# Altium schematic sheet RF.SchDoc: RF Connectors
size A; DocumentNumber: 10; SheetNumber: 10; SheetTotal: 11
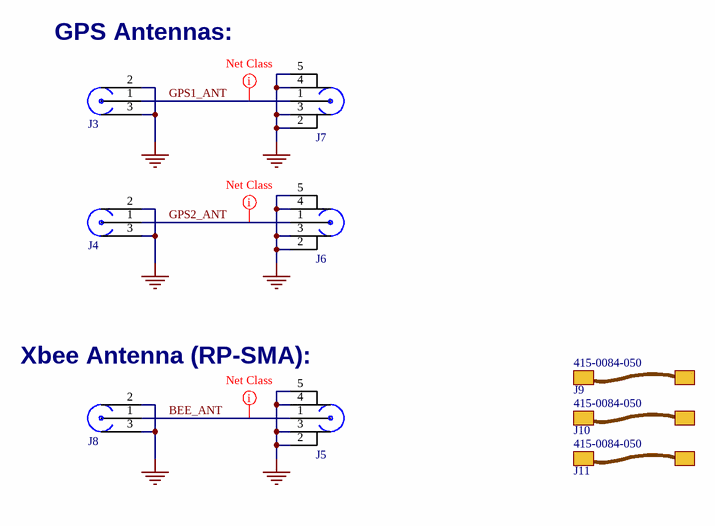
[diagram p0: RF.SchDoc]

## Parts
J3  RF - GND x 2  [RF UMC SMD]  (value not drawn)
J4  RF - GND x 2  [RF UMC SMD]  (value not drawn)
J5  RF - GND x 4  [RF RPSMA End Launch]  (value not drawn)
J6  RF - GND x 4  [RF SMA End Launch 2]  (value not drawn)
J7  RF - GND x 4  [RF SMA End Launch 2]  (value not drawn)
J8  RF - GND x 2  [RF UMC SMD]  (value not drawn)
J9  Manufacturer Part Number: 415-0084-050  (hidden comment: Cable Assembly)  (mechanical)
J10  Manufacturer Part Number: 415-0084-050  (hidden comment: Cable Assembly)  (mechanical)
J11  Manufacturer Part Number: 415-0084-050  (hidden comment: Cable Assembly)  (mechanical)

## Nets
GND: J3.2 J3.3 J4.2 J4.3 J5.2 J5.3 J5.4 J5.5 J6.2 J6.3 J6.4 J6.5 J7.2 J7.3 J7.4 J7.5 J8.2 J8.3
BEE_ANT: J5.1 J8.1
GPS1_ANT: J3.1 J7.1
GPS2_ANT: J4.1 J6.1

## Layout directives
net class RF_GPS: BEE_ANT, GPS1_ANT, GPS2_ANT

## Notes on the sheet
- (near J3) GPS Antennas:
- Xbee Antenna (RP-SMA):
- Date
- Sheet
- Project
- Time
- PCB
- Assy
- of
- Size
- A
- File

## Library data of the parts
J3 J4 J8 = RF - GND x 2: CONN UMC RCPT STR 50 OHM SMD; Manufacturer: Emerson Network Power Connectivity Johnson; Manufacturer Part Number: 128-0711-201; Connector Style: Ultra Miniature Coaxial; Connector Type: Receptacle, Male Pins; Contact Termination: Solder; Impedance: 50 Ohm; Frequency - Max: 6GHz; Body Finish: Gold; Voltage Rating: 200V; Supplier 1: Digi-Key; Supplier Part Number 1: J983CT-ND; RoHS: RoHS Compliant; Category: Connectors, Interconnects; Stock 1: 1514; Pricing 1: 1=0.93, 10=0.832, 50=0.784, 100=0.672, 250=0.576, 500=0.544, 750=0.48, 1000=0.448 (USD); Packaging: Cut Tape (CT); Shield Termination: Solder; Mounting Type: Surface Mount; Cable Group: -; Fastening Type: Snap-On; Features: -; Housing Color: Gold; Ingress Protection: -; Body Material: -; Center Contact Material: -; Center Contact Plating: Gold; Dielectric Material: -; Operating Temperature: -40°C ~ 90°C; ComponentLink1URL: http://media.digikey.com/pdf/Data%20Sheets/Emerson%20PDFs/UMC%20Product%20Catalog.pdf; ComponentLink1Description: http://media.digikey.com/pdf/Data%20Sheets/Emerson%20PDFs/UMC%20Product%20Catalog.pdf
J5 = RF - GND x 4: CONN RPSMA JCK STR 50OHM EDGEMNT; Manufacturer: Amphenol Connex; Manufacturer Part Number: 132255RP; Body Material: Brass; Body Plating: Gold; Dielectric Material: PTFE; Impedance: 50R; Mating Cycles: 500; Connector Type: Coaxial,Male Pin,SMA; Max Frequency: 18GHz; Voltage Rating: 375V; Board Thickness: 0.062inch; Supplier 1: Digi-Key; Supplier Part Number 1: ACX1425-ND; Stock 1: 513; Pricing 1: 1=7.75, 10=7.429, 25=6.7832, 50=6.46, 100=6.137, 250=5.491, 500=5.168, 1000=4.522 (USD); Mount: Edge,PCB; Case/Package: SMA; Weight: 0.126986oz; Contact Plating: Gold; Contact Material: Copper; Housing Colour: Gold; Insulation Material: Polytetrafluoroethylene; Min Operating Temperature: -65°C; Max Operating Temperature: 165°C; Package Quantity: 1; Fastening Type: Threaded; Packaging: Bulk; Termination: Solder; Frequency: 18GHz; Orientation: Straight; Length: 9.52mm; Depth: 7.92mm; Radiation Hardening: No; REACH SVHC: Unknown
J6 J7 = RF - GND x 4: CONN SMA RCPT STR 50OHM EDGE MNT; Manufacturer: Molex; Manufacturer Part Number: 0732511150; Body Material: Brass; Body Plating: Gold; Dielectric Material: PTFE; Impedance: 50R; Connector Type: SMA,Socket; Max Frequency: 18GHz; Voltage Rating: 500V; Supplier 1: Digi-Key; Supplier Part Number 1: WM5534-ND; Stock 1: 22842; Pricing 1: 1=3.33, 10=3.193, 25=2.9272, 50=2.7942, 100=2.6612, 250=2.32856, 500=2.26202, 1600=1.86284, 3200=1.79631 (USD); Mount: Edge; Case/Package: SMA; Contact Plating: Gold; Contact Material: Copper; Insulation Material: Polytetrafluoroethylene; Housing Colour: Gold; Min Operating Temperature: -65°C; Max Operating Temperature: 165°C; Packaging: Tray; Termination: Solder; Package Quantity: 1600; Fastening Type: Threaded; Length: 9.53mm; Depth: 9.53mm; Radiation Hardening: No; Lead Free: Lead Free
J9-J11 = Cable Assembly: CBL ASSY UMCC PLUG-PLUG 1.969"; Manufacturer: Bel Cinch; Wire/Cable Type: Coaxial; Impedance: 50R; Gender Type A: Male; Gender: Female to Female; Polarity: Normal; Connector Type A: Coaxial,Plug,Socket; Max Frequency: 6GHz; Cable Length: 0.05m; Supplier 1: Digi-Key; Supplier Part Number 1: J918-ND; Stock 1: 0; Mount: Cable; Color: White; Contact Plating: Gold; Min Operating Temperature: -40°C; Max Operating Temperature: 90°C; Packaging: Bulk; Gender Type B: Male; Package Quantity: 5; Connector Type B: Coaxial,Plug,Socket; Features: Shielded; Length: 1.97inch; Radiation Hardening: No; ComponentLink1URL: http://www.mouser.com/ds/2/643/dr-415-0084-050-738560.pdf; ComponentLink1Description: http://www.mouser.com/ds/2/643/dr-415-0084-050-738560.pdf